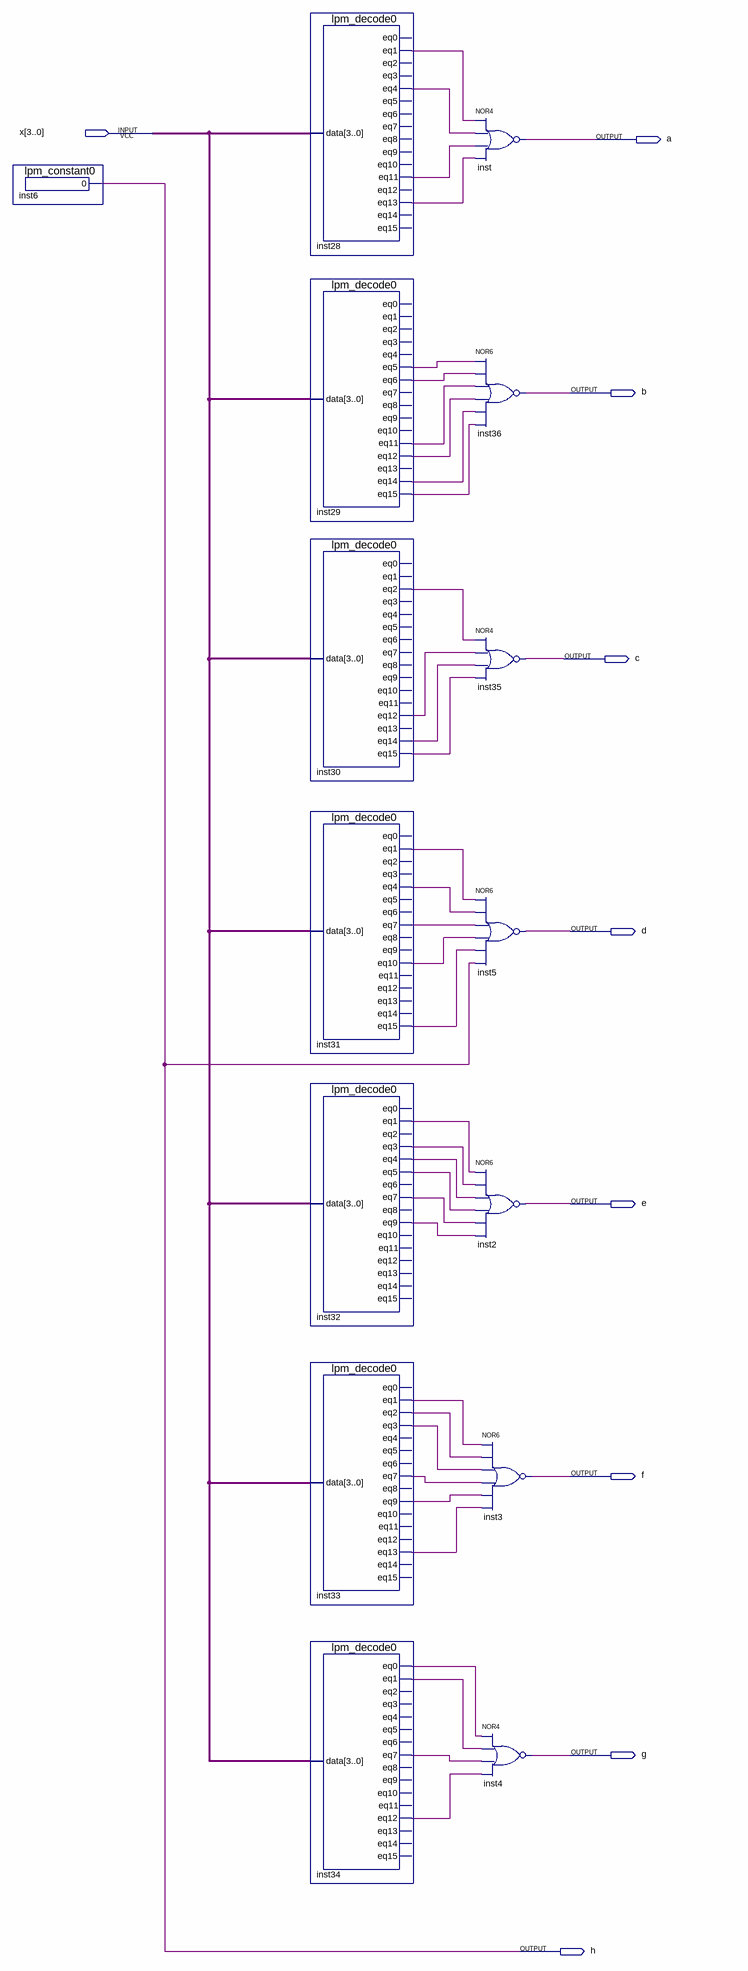
[diagram p0: schematic sheet]
// Quartus schematic Laboratory_work_2_project.bdf as structural Verilog: 15 symbols, 9 pins
module Laboratory_work_2_project (
  input  [3:0] x,
  output a,
  output b,
  output c,
  output d,
  output e,
  output f,
  output g,
  output h
);

  wire inst28_eq1, inst28_eq4, inst28_eq11, inst28_eq13, inst29_eq5, inst29_eq6, inst29_eq11, inst29_eq12,
       inst29_eq14, inst29_eq15, inst30_eq2, inst30_eq12, inst30_eq14, inst30_eq15, inst31_eq1, inst31_eq4,
       inst31_eq7, inst31_eq10, inst31_eq15, inst32_eq1, inst32_eq3, inst32_eq4, inst32_eq5, inst32_eq7,
       inst32_eq9, inst33_eq1, inst33_eq2, inst33_eq3, inst33_eq7, inst33_eq9, inst33_eq13, inst34_eq0,
       inst34_eq1, inst34_eq7, inst34_eq12;

  lpm_constant0 inst6 (.result(h));
  lpm_decode0 inst28 (
    .data(x), .eq1(inst28_eq1), .eq4(inst28_eq4), .eq11(inst28_eq11), .eq13(inst28_eq13));  // open: eq0, eq2, eq3, eq5, eq6, eq7, eq8, eq9, eq10, eq12, eq14, eq15
  lpm_decode0 inst29 (
    .data(x), .eq5(inst29_eq5), .eq6(inst29_eq6), .eq11(inst29_eq11), .eq12(inst29_eq12), .eq14(inst29_eq14),
    .eq15(inst29_eq15));  // open: eq0, eq1, eq2, eq3, eq4, eq7, eq8, eq9, eq10, eq13
  lpm_decode0 inst30 (
    .data(x), .eq2(inst30_eq2), .eq12(inst30_eq12), .eq14(inst30_eq14), .eq15(inst30_eq15));  // open: eq0, eq1, eq3, eq4, eq5, eq6, eq7, eq8, eq9, eq10, eq11, eq13
  lpm_decode0 inst31 (
    .data(x), .eq1(inst31_eq1), .eq4(inst31_eq4), .eq7(inst31_eq7), .eq10(inst31_eq10), .eq15(inst31_eq15));  // open: eq0, eq2, eq3, eq5, eq6, eq8, eq9, eq11, eq12, eq13, eq14
  lpm_decode0 inst32 (
    .data(x), .eq1(inst32_eq1), .eq3(inst32_eq3), .eq4(inst32_eq4), .eq5(inst32_eq5), .eq7(inst32_eq7),
    .eq9(inst32_eq9));  // open: eq0, eq2, eq6, eq8, eq10, eq11, eq12, eq13, eq14, eq15
  lpm_decode0 inst33 (
    .data(x), .eq1(inst33_eq1), .eq2(inst33_eq2), .eq3(inst33_eq3), .eq7(inst33_eq7), .eq9(inst33_eq9),
    .eq13(inst33_eq13));  // open: eq0, eq4, eq5, eq6, eq8, eq10, eq11, eq12, eq14, eq15
  lpm_decode0 inst34 (
    .data(x), .eq0(inst34_eq0), .eq1(inst34_eq1), .eq7(inst34_eq7), .eq12(inst34_eq12));  // open: eq2, eq3, eq4, eq5, eq6, eq8, eq9, eq10, eq11, eq13, eq14, eq15
  nor inst (a, inst28_eq1, inst28_eq4, inst28_eq11, inst28_eq13);
  nor inst36 (b, inst29_eq5, inst29_eq6, inst29_eq11, inst29_eq12, inst29_eq14, inst29_eq15);
  nor inst35 (c, inst30_eq2, inst30_eq12, inst30_eq14, inst30_eq15);
  nor inst5 (d, inst31_eq1, inst31_eq4, inst31_eq7, inst31_eq10, inst31_eq15, h);
  nor inst2 (e, inst32_eq1, inst32_eq3, inst32_eq4, inst32_eq5, inst32_eq7, inst32_eq9);
  nor inst3 (f, inst33_eq1, inst33_eq2, inst33_eq3, inst33_eq7, inst33_eq9, inst33_eq13);
  nor inst4 (g, inst34_eq0, inst34_eq1, inst34_eq7, inst34_eq12);
endmodule
